# Altium schematic sheet Att_steet_1.SchDoc
size A; DocumentNumber: 1; SheetNumber: 2; SheetTotal: 2
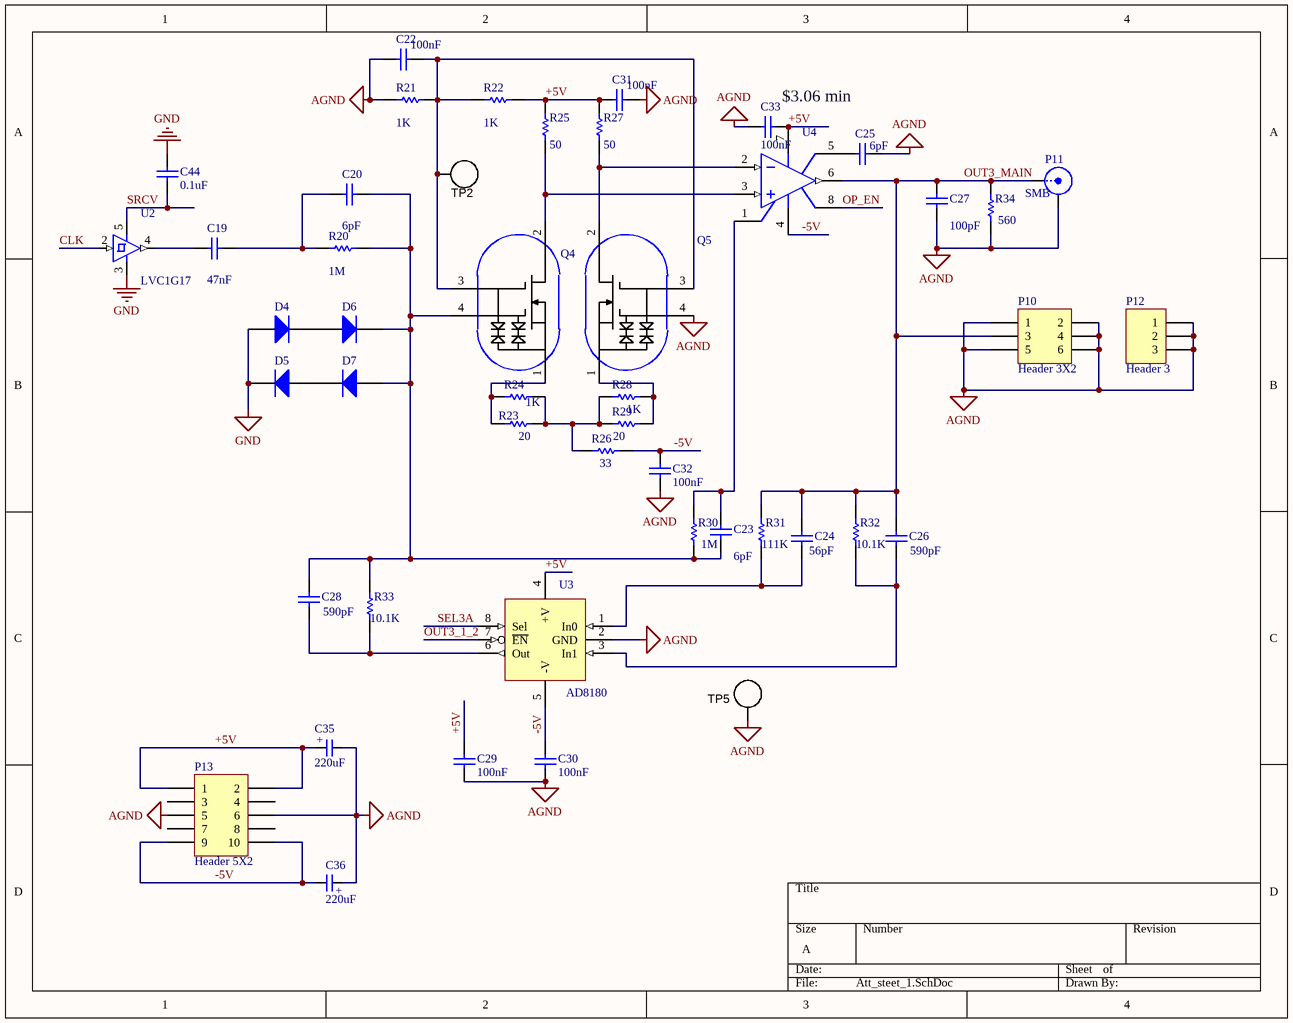
[diagram p0: Att_steet_1.SchDoc]

## Parts
C19  value 47nF  [0805]  (hidden comment: C0805)
C20  value 6pF  [0805]  (hidden comment: C0805)
C22  value 100nF  [0805]  (hidden comment: C0805)
C23  value 6pF  [0805]  (hidden comment: C0805)
C24  value 56pF  [0805]  (hidden comment: C0805)
C25  value 6pF  [C0805]  (hidden comment: Cap Semi)
C26  value 590pF  [0805]  (hidden comment: C0805)
C27  value 100pF  [0805]  (hidden comment: C0805)
C28  value 590pF  [0805]  (hidden comment: C0805)
C29  value 100nF  [0805]  (hidden comment: C0805)
C30  value 100nF  [0805]  (hidden comment: C0805)
C31  value 100nF  [0805]  (hidden comment: C0805)
C32  value 100nF  [0805]  (hidden comment: C0805)
C33  value 100nF  [0805]  (hidden comment: C0805)
C35  value 220uF  [H13]  (hidden comment: Cap)
C36  value 220uF  [H13]  (hidden comment: Cap)
C44  value 0.1uF  [C0805]  (hidden comment: Cap)
D4  Diode BAS21  [SOT95P240-3N]  (value not drawn)
D5  Diode BAS21  [SOT95P240-3N]  (value not drawn)
D6  Diode BAS21  [SOT95P240-3N]  (value not drawn)
D7  Diode BAS21  [SOT95P240-3N]  (value not drawn)
P10  Header 3X2  [HDR2X3]
P11  SMB  [SMB_V-RJ45]
P12  Header 3  [HDR1X3]
P13  Header 5X2  [HDR2X5]
Q4  MOSFET  [SOT143]  (value not drawn)
Q5  MOSFET  [SOT143]  (value not drawn)
R20  value 1M  [0805]  (hidden comment: ERA6Y)
R21  value 1K  [0805]  (hidden comment: ERA6Y)
R22  value 1K  [0805]  (hidden comment: ERA6Y)
R23  value 20  [0805]  (hidden comment: ERA6Y)
R24  value 1K  [0805]  (hidden comment: ERA6Y)
R25  value 50  [0805]  (hidden comment: ERA6Y)
R26  value 33  [0805]  (hidden comment: ERA6Y)
R27  value 50  [0805]  (hidden comment: ERA6Y)
R28  value 1K  [0805]  (hidden comment: ERA6Y)
R29  value 20  [0805]  (hidden comment: ERA6Y)
R30  value 1M  [0805]  (hidden comment: ERA6Y)
R31  value 111K  [0805]  (hidden comment: ERA6Y)
R32  value 10.1K  [0805]  (hidden comment: ERA6Y)
R33  value 10.1K  [0805]  (hidden comment: ERA6Y)
R34  value 560  [0805]  (hidden comment: ERA6Y)
TP2  TESTPOINT  [TESTPOINT]  (value not drawn)  (no BOM)
TP5  TESTPOINT  [TESTPOINT]  (value not drawn)  (no BOM)
U2  value LVC1G17  [SC_70_5]  (hidden comment: SN74LVC1G17)
U3  AD8180  [SOIC127P600-8AL]
U4  AD707AR  [SO-8_N]  (value not drawn)

## Nets
AGND: C22.1 C25.2 C27.1 C29.2 C30.2 C31.2 C32.1 C33.2 C35.2 C36.1 P10.1 P10.2 P10.4 P10.5 P10.6 P11.2(Y) P12.1 P12.2 P12.3 P13.5 P13.6 Q5.4 R21.2 R34.1 TP5.1 U3.2(GND)
GND: C44.2 D4.1(A) D5.3(K) U2.3(GND)
+5V: C29.1 C31.1 C33.1 C35.1 P13.1 P13.2 R22.1 R25.1 R27.1 U3.4(+V) U4.7(V+)
-5V: C30.1 C32.2 C36.2 P13.9 P13.10 R26.1 U3.5(-V) U4.4(V-)
CLK: U2.2(1A)
OP_EN: U4.8(NULL2)
OUT3_1_2: U3.7(~{EN})
OUT3_MAIN: C24.2 C26.2 C27.2 P10.3 P11.1(X) R31.2 R32.2 R34.2 U4.6(OUT)
SEL3A: U3.8(Sel)
SRCV: C44.1 U2.5(VCC)
NetC19_1: C19.1 U2.4(1Y)
NetC19_2: C19.2 C20.1 R20.2
NetC20_2: C20.2 C23.1 C28.2 D6.3(K) D7.1(A) Q4.4 R20.1 R30.1 R33.2
NetC22_2: C22.2 Q4.3 Q5.3 R21.1 R22.2 TP2.1
NetC23_2: C23.2 R30.2 U4.1(NULL1)
NetC24_1: C24.1 R31.1 U3.1(In0)
NetC25_1: C25.1 U4.5(NC)
NetC26_1: C26.1 R32.1 U3.3(In1)
NetC28_1: C28.1 R33.1 U3.6(Out)
NetD4_3: D4.3(K) D6.1(A)
NetD5_1: D5.1(A) D7.3(K)
NetQ4_1: Q4.1 R23.2 R24.2
NetQ4_2: Q4.2 R25.2 U4.3(IN+)
NetQ5_1: Q5.1 R28.1 R29.1
NetQ5_2: Q5.2 R27.2 U4.2(IN-)
NetR23_1: R23.1 R24.1 R26.2 R28.2 R29.2

Not connected (* = marked no-connect by the designer): P13 3 4 7 8

## Notes on the sheet
- (near C33) $3.06 min
- (in symbol Lyt Cap) +

## Library data of the parts
C19 C20 C22-C24 C26-C33 = C0805: Ceramic Chip Capacitor - Standard; Note: Footprint corresponds to dimensions for bulk cassette packaging. This case size has tightened tolerances.; Published: 17-Jul-2002; LatestRevisionDate: 19-Mar-2004; LatestRevisionNote: Silkscreen size reduced.; DatasheetDocument: Mar-2001; PackageDocument: Mar-2001; PackageReference: 0805; Publisher: Altium Limited; Code_JEITA: 0805; Code_IPC: 2012[0805]; ComponentLink1Description: Manufacturer Link; ComponentLink1URL: http://www.kemet.com/; ComponentLink2Description: Datasheet; ComponentLink2URL: http://www.kemet.com/kemet/web/homepage/kechome.nsf/vapubfilesname/F3102TA.pdf/$file/F3102TA.pdf
C25 = Cap Semi: Capacitor (Semiconductor SIM Model); Published: 8-Jun-2000; LatestRevisionDate: 29-May-2009; LatestRevisionNote: IPC-7351 Footprint Added.; PackageReference: C1206; Publisher: Altium Limited; PackageDescription: Chip Capacitor
C35 C36 = Lyt Cap: Manufacturer: Panasonic; Type: Aluminum Lyt Cap
C44 = Cap: Capacitor; Published: 8-Jun-2000; LatestRevisionDate: 17-Jul-2002; LatestRevisionNote: Re-released for DXP Platform.; PackageReference: RAD-0.3; Publisher: Altium Limited; Supplier 1: Newark; Supplier Part Number 1: 06R3744
D4-D7 = Diode BAS21: Silicon Switching Diode for High-Speed, High-Voltage Switching; Note: Pin 2 is not connected and not drawn.; Published: 21-Mar-2003; LatestRevisionDate: 29-May-2009; LatestRevisionNote: IPC-7351 Footprint Added.; DatasheetVersion: Oct-1999; PackageVersion: Sep-2001; PackageReference: SOT-23; Publisher: Altium Limited; PackageDescription: 3-Pin SOT-23 Package 0.95 mm Pitch, 2.5 mm Lead Span; ComponentLink1Description: Manufacturer Link; ComponentLink1URL: http://www.infineon.com/; ComponentLink2Description: Datasheet; ComponentLink2URL: http://www.infineon.com/upload/Document/cmc_upload/documents/080/812/bas21series.pdf
P10 = Header 3X2: Header, 3-Pin, Dual row; LatestRevisionDate: 17-Jul-2002; LatestRevisionNote: Re-released for DXP Platform.; Publisher: Altium Limited
P11 = SMB: SMB Straight Connector; LatestRevisionDate: 17-Jul-2002; LatestRevisionNote: Re-released for DXP Platform.; Publisher: Altium Limited
P12 = Header 3: Header, 3-Pin; LatestRevisionDate: 17-Jul-2002; LatestRevisionNote: Re-released for DXP Platform.; Publisher: Altium Limited
P13 = Header 5X2: Header, 5-Pin, Dual row; LatestRevisionDate: 17-Jul-2002; LatestRevisionNote: Re-released for DXP Platform.; Publisher: Altium Limited
Q4 = BF998: Dual-gate MOSFET; Manufacturer: NXP; Layout variant: Regular; Distibutor 1: Mouser
Q5 = BF998: Dual-gate MOSFET; Manufacturer: NXP; Layout variant: Regular
R20-R34 = ERA6Y: Rectangular Thick Film Chip Resistor, 10 Ohm to 1M Ohm Range, 0.1% and 0.5% Tolerance, 0805 Size, 0.1 W; Note: If flow soldering, adjust pad width of PCB Footprint to 0.7 - 0.8 times the width of the resistor.; Published: 17-Dec-2003; LatestRevisionDate: 19-Mar-2004; LatestRevisionNote: Silkscreen size reduced.; Publisher: Altium Limited; PackageDocument: Mar-2003; Code_IPC: 2012 [0805]; ComponentLink1Description: Manufacturer Link; ComponentLink1URL: http://www.panasonic.com/industrial/components/resistive_products.htm; ComponentLink2Description: Datasheet; ComponentLink2URL: http://www.panasonic.com/industrial/components/pdf/AOA0000CE8.pdf
  R20-R24 R26-R34: PackageReference: ERA-0805
  R25: PackageReference: 0805
TP2 TP5 = TESTPOINT: TEST POINT.  No entry in BOM.; SymbolVersion: 2009-02-23; CompType: Testpoint; Manufacturer: *; PartNumber: *; RoHS: Yes; CompType: *
U2 = SN74LVC1G17: Manufacturer: Texas Instruments; Manufacturer Part Number: SN74LVC1G17DCKR; CompType: Buffer IC; Supplier 1: Newark; Supplier 2: Digi-Key; Supplier Part Number 1: 26M3321; Supplier Part Number 2: 296-11934-1-ND
U4 = AD707AR: Ultra-Low Drift Operational Amplifier; PartNumber: AD8099; Note: Pin 5 is not connected.; ComponentAvailability: Obsolete; Published: 8-Jun-2000; LatestRevisionDate: 13-Apr-2006; LatestRevisionNote: IPC-7351 Footprint Added.; DatasheetVersion: REV. B 1995; PackageVersion: revA; PackageReference: SO-8; Publisher: Altium Limited; PackageDescription: 8-Pin Small Outline Integrated Circuit 1.27 mm Pitch; Code_JEDEC: MS-012-AA; Code_IPC: SOIC127P600-8; ComponentLink1Description: Manufacturer Link; ComponentLink1URL: http://www.analog.com/; ComponentLink2Description: Datasheet; ComponentLink2URL: http://www.analog.com/UploadedFiles/Obsolete_Data_Sheets/2143387AD707.pdf
U3 = AD8180: Supplier 1: Digi-Key; PartNumber: AD8180; Supplier Part Number 1: AD8180ARZ-ND